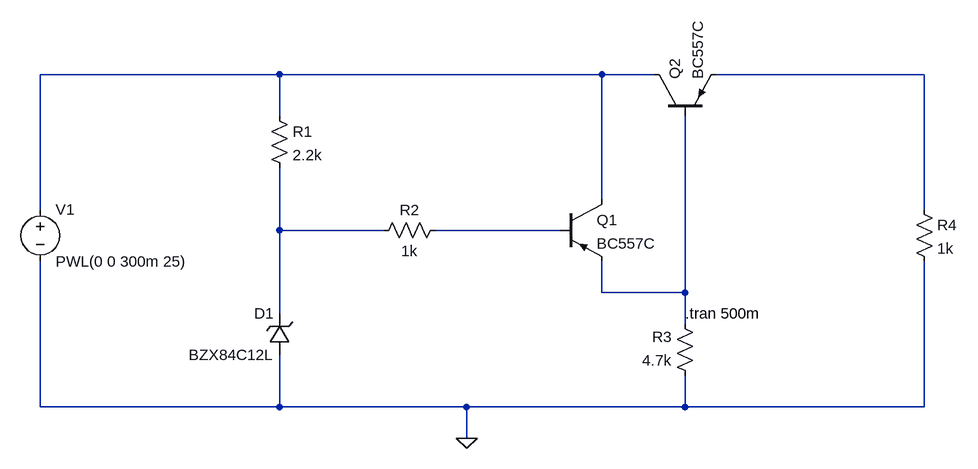
[diagram p0: schematic pnp.asc]
pnp.asc, the LTspice schematic file:
Version 4
SHEET 1 992 680
WIRE -64 80 -432 80
WIRE 432 80 -64 80
WIRE 512 80 432 80
WIRE 928 80 608 80
WIRE -64 144 -64 80
WIRE 432 272 432 80
WIRE -432 288 -432 80
WIRE 928 288 928 80
WIRE -64 320 -64 224
WIRE 96 320 -64 320
WIRE 368 320 176 320
WIRE 432 416 432 368
WIRE 560 416 560 144
WIRE 560 416 432 416
WIRE -64 448 -64 320
WIRE 560 464 560 416
WIRE -432 592 -432 368
WIRE -64 592 -64 512
WIRE -64 592 -432 592
WIRE 224 592 -64 592
WIRE 560 592 560 544
WIRE 560 592 224 592
WIRE 928 592 928 368
WIRE 928 592 560 592
WIRE 224 640 224 592
FLAG 224 640 0
SYMBOL res -80 128 R0
SYMATTR InstName R1
SYMATTR Value 2.2k
SYMBOL res 192 304 R90
WINDOW 0 0 56 VBottom 2
WINDOW 3 32 56 VTop 2
SYMATTR InstName R2
SYMATTR Value 1k
SYMBOL res 576 560 R180
WINDOW 0 36 76 Left 2
WINDOW 3 36 40 Left 2
SYMATTR InstName R3
SYMATTR Value 4.7k
SYMBOL pnp2 368 272 R0
SYMATTR InstName Q1
SYMATTR Value BC557C
SYMBOL pnp2 512 144 R270
SYMATTR InstName Q2
SYMATTR Value BC557C
SYMBOL zener -48 512 R180
WINDOW 0 24 64 Left 2
WINDOW 3 24 0 Left 2
SYMATTR InstName D1
SYMATTR Value BZX84C12L
SYMBOL Res 912 272 R0
SYMATTR InstName R4
SYMATTR Value 1k
SYMBOL voltage -432 272 R0
SYMATTR InstName V1
SYMATTR Value PWL(0 0 300m 25)
TEXT 560 448 Left 2 !.tran 500m

The netlist it stands for:
* pnp.asc
R1 N001 N003 2.2k
R2 N004 N003 1k
R3 0 N005 4.7k
Q1 N001 N004 N005 0 BC557C
Q2 N001 N005 N002 0 BC557C
D1 0 N003 BZX84C12L
R4 N002 0 1k
V1 N001 0 PWL(0 0 300m 25)
.model D D
.lib standard.dio
.model NPN NPN
.model PNP PNP
.lib standard.bjt
.tran 500m
.backanno
.end